# Altium schematic sheet cat_cup.SchDoc
size A4
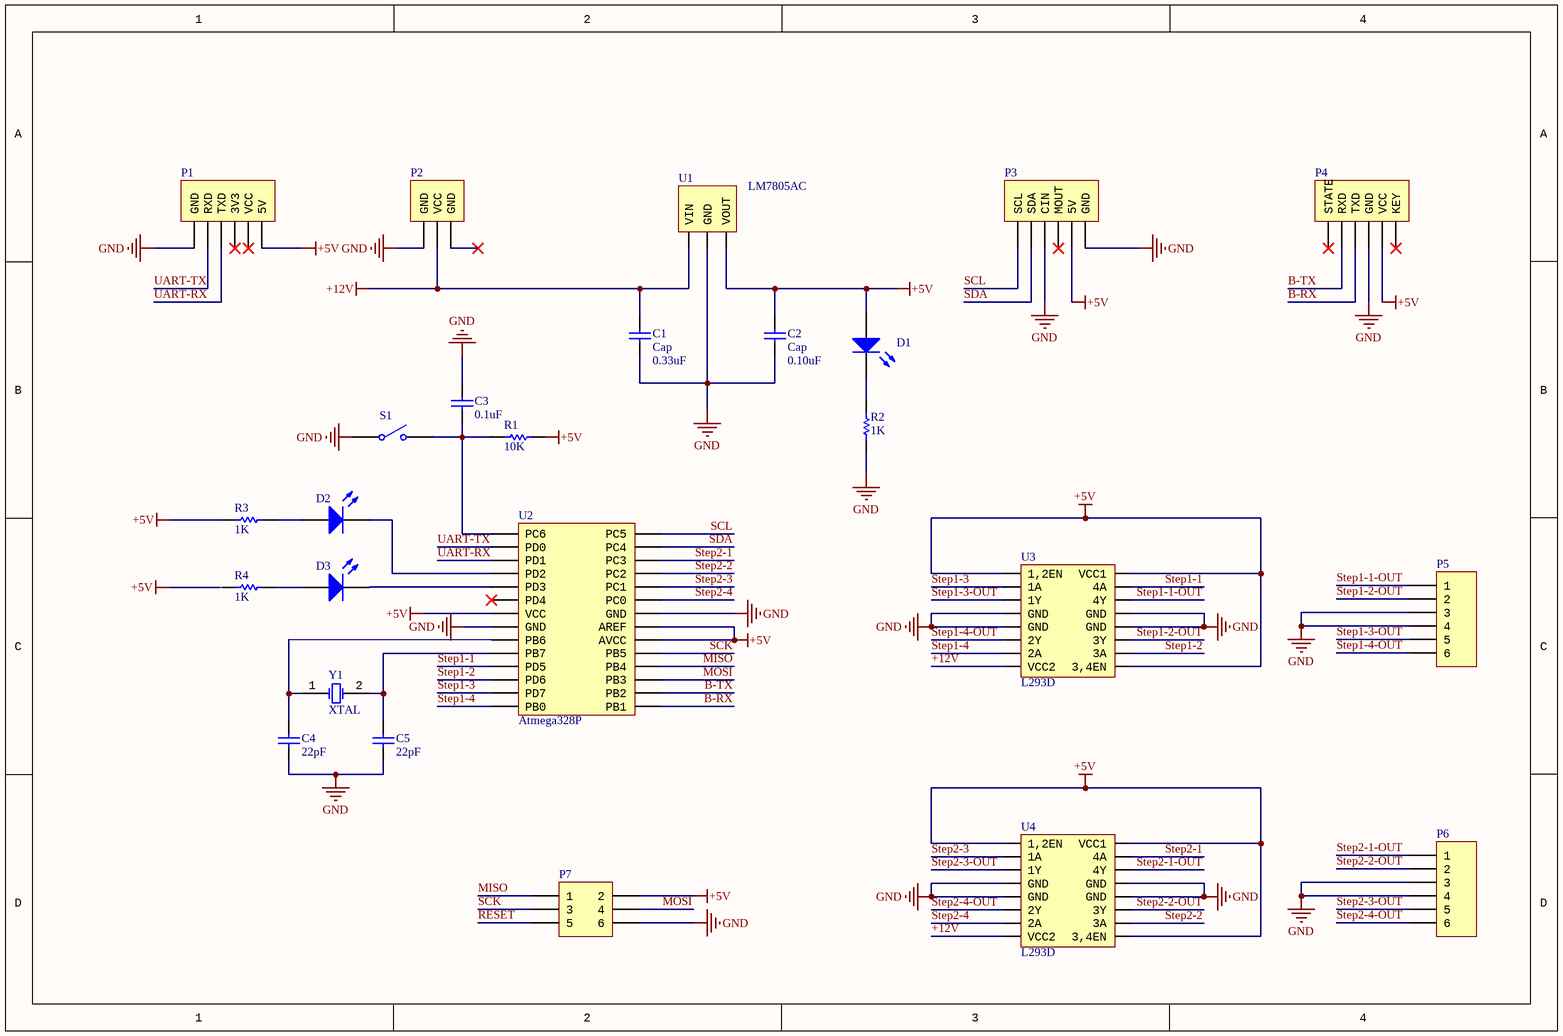
[diagram p0: cat_cup.SchDoc]

## Parts
C1  Cap  value 0.33uF  [RAD-0.3]
C2  Cap  value 0.10uF  [RAD-0.3]
C3  value 0.1uF  [RAD-0.3]  (hidden comment: Cap)
C4  value 22pF  [RAD-0.3]  (hidden comment: Cap)
C5  value 22pF  [RAD-0.3]  (hidden comment: Cap)
D1  LED0  [LED-0]  (value not drawn)
D2  LED0  [LED-0]  (value not drawn)
D3  LED0  [LED-0]  (value not drawn)
P1  Header 6  [HDR1X6]  (value not drawn)
P2  Header 3  [HDR1X3]  (value not drawn)
P3  MHDR1X6  [MHDR1X6]  (value not drawn)
P4  MHDR1X6  [MHDR1X6]  (value not drawn)
P5  MHDR1X6  [MHDR1X6]  (value not drawn)
P6  MHDR1X6  [MHDR1X6]  (value not drawn)
P7  MHDR2X3  [MHDR2X3]  (value not drawn)
R1  value 10K  [AXIAL-0.5]  (hidden comment: Res Semi)
R2  value 1K  [AXIAL-0.5]  (hidden comment: Res Semi)
R3  value 1K  [AXIAL-0.5]  (hidden comment: Res Semi)
R4  value 1K  [AXIAL-0.5]  (hidden comment: Res Semi)
S1  SW-SPST  [SPST-2]  (value not drawn)
U1  LM7805AC
U2  Atmega328P
U3  L293D
U4  L293D
Y1  XTAL  [R38]

## Nets
+5V: C2.1 D1.1(A) P1.6(5V) P3.5(5V) P4.5(VCC) P7.2 R1.2 R3.1 U1.3(VOUT) U2.7(VCC) U2.20(AVCC) U2.21(AREF) U3.1(1,2EN) U3.9(3,4EN) U3.16(VCC1) U4.1(1,2EN) U4.9(3,4EN) U4.16(VCC1)
+12V: C1.1 P2.2(VCC) U1.1(VIN) U3.8(VCC2) U4.8(VCC2)
GND: C1.2 C2.2 C3.1 C4.1 C5.1 P1.1(GND) P2.1(GND) P3.3(CIN) P3.6(GND) P4.4(GND) P5.3 P5.4 P6.3 P6.4 P7.6 R2.2 S1.1(COMMON) U1.2(GND) U2.8(GND) U2.22(GND) U3.4(GND) U3.5(GND) U3.12(GND) U3.13(GND) U4.4(GND) U4.5(GND) U4.12(GND) U4.13(GND)
B-RX: P4.3(TXD) U2.15(PB1)
B-TX: P4.2(RXD) U2.16(PB2)
MISO: P7.1 U2.18(PB4)
MOSI: P7.4 U2.17(PB3)
RESET: P7.5
SCK: P7.3 U2.19(PB5)
SCL: P3.1(SCL) U2.28(PC5)
SDA: P3.2(SDA) U2.27(PC4)
Step1-1: U2.11(PD5) U3.15(4A)
Step1-1-OUT: P5.1 U3.14(4Y)
Step1-2: U2.12(PD6) U3.10(3A)
Step1-2-OUT: P5.2 U3.11(3Y)
Step1-3: U2.13(PD7) U3.2(1A)
Step1-3-OUT: P5.5 U3.3(1Y)
Step1-4: U2.14(PB0) U3.7(2A)
Step1-4-OUT: P5.6 U3.6(2Y)
Step2-1: U2.26(PC3) U4.15(4A)
Step2-1-OUT: P6.1 U4.14(4Y)
Step2-2: U2.25(PC2) U4.10(3A)
Step2-2-OUT: P6.2 U4.11(3Y)
Step2-3: U2.24(PC1) U4.2(1A)
Step2-3-OUT: P6.5 U4.3(1Y)
Step2-4: U2.23(PC0) U4.7(2A)
Step2-4-OUT: P6.6 U4.6(2Y)
UART-RX: P1.3(TXD) U2.3(PD1)
UART-TX: P1.2(RXD) U2.2(PD0)
NetC3_2: C3.2 R1.1 S1.2(NO) U2.1(PC6)
NetC4_2: C4.2 U2.9(PB6) Y1.1(OSC1)
NetC5_2: C5.2 U2.10(PB7) Y1.2(OSC2)
NetD1_2: D1.2(K) R2.1
NetD2_1: D2.1(A) R3.2
NetD2_2: D2.2(K) U2.4(PD2)
NetD3_1: D3.1(A) R4.2
NetD3_2: D3.2(K) U2.5(PD3)

Not connected (* = marked no-connect by the designer): P1 4(3V3)* 5(VCC)*; P2 3(GND)*; P3 4(MOUT)*; P4 1(STATE)* 6(KEY)*; R4 1; U2 6(PD4)*

## Library data of the parts
C1-C5 = Cap: Capacitor; Published: 8-Jun-2000; LatestRevisionDate: 17-Jul-2002; LatestRevisionNote: Re-released for DXP Platform.; PackageReference: RAD-0.3; Publisher: Altium Limited; PackageDescription: Radial Cap, Thru-Hole; 2 Leads; 0.3 in Pin Spacing
D1-D3 = LED0: Typical INFRARED GaAs LED; Published: 8-Jun-2000; LatestRevisionDate: 08-Jul-2005; LatestRevisionNote: Mech Layer 1 removed.; PackageReference: LED-0; Publisher: Altium Limited; PackageDescription: LED; 2 Leads
P1 = Header 6: Header, 6-Pin; LatestRevisionDate: 17-Jul-2002; LatestRevisionNote: Re-released for DXP Platform.; Publisher: Altium Limited
P2 = Header 3: Header, 3-Pin; LatestRevisionDate: 17-Jul-2002; LatestRevisionNote: Re-released for DXP Platform.; Publisher: Altium Limited
P3-P6 = MHDR1X6: Header, 6-Pin; LatestRevisionDate: 17-Jul-2002; LatestRevisionNote: Re-released for DXP Platform.; Publisher: Altium Limited
P7 = MHDR2X3: Header, 3-Pin, Dual row; LatestRevisionDate: 17-Jul-2002; LatestRevisionNote: Re-released for DXP Platform.; Publisher: Altium Limited
R1-R4 = Res Semi: Semiconductor Resistor; Published: 8-Jun-2000; LatestRevisionDate: 17-Jul-2002; LatestRevisionNote: Re-released for DXP Platform.; PackageReference: AXIAL-0.5; Publisher: Altium Limited; PackageDescription: Axial Device, Thru-Hole; 2 Leads; 0.5 in Pin Spacing
S1 = SW-SPST: Single-Pole, Single-Throw Switch; Published: 24-Mar-1999; LatestRevisionDate: 17-Jul-2002; LatestRevisionNote: Re-released for DXP Platform.; PackageReference: SPST-2; Publisher: Altium Limited; PackageDescription: Switch; 2 Leads
U2 = Atmega328
Y1 = XTAL: Crystal Oscillator; Published: 8-Jun-2000; LatestRevisionDate: 17-Jul-2002; LatestRevisionNote: Re-released for DXP Platform.; PackageReference: R38; Publisher: Altium Limited; PackageDescription: Crystal, Thru-Hole; 2 Leads; Body 3.1 x 8.2 mm (Dia.xH)